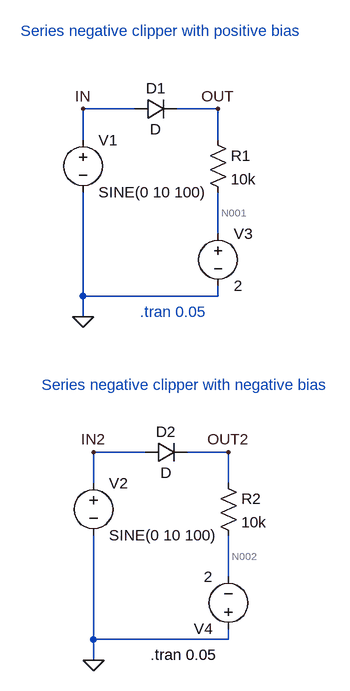
[diagram p0: schematic Series_Negative_clipper_with_bias.asc]
Series_Negative_clipper_with_bias.asc, the LTspice schematic file:
Version 4.1
SHEET 1 880 932
WIRE 176 64 96 64
WIRE 304 64 240 64
WIRE 96 112 96 64
WIRE 304 112 304 64
WIRE 304 256 304 192
WIRE 96 352 96 192
WIRE 304 352 304 336
WIRE 304 352 96 352
WIRE 96 384 96 352
WIRE 192 592 112 592
WIRE 320 592 256 592
WIRE 112 640 112 592
WIRE 320 640 320 592
WIRE 320 784 320 720
WIRE 112 880 112 720
WIRE 320 880 320 864
WIRE 320 880 112 880
WIRE 112 912 112 880
FLAG 96 64 IN
FLAG 304 64 OUT
FLAG 96 384 0
FLAG 112 592 IN2
FLAG 320 592 OUT2
FLAG 112 912 0
SYMBOL voltage 96 96 R0
WINDOW 123 0 0 Left 0
WINDOW 39 0 0 Left 0
SYMATTR InstName V1
SYMATTR Value SINE(0 10 100)
SYMBOL diode 176 80 R270
WINDOW 0 32 32 VTop 2
WINDOW 3 0 32 VBottom 2
SYMATTR InstName D1
SYMBOL res 288 96 R0
SYMATTR InstName R1
SYMATTR Value 10k
SYMBOL voltage 304 240 R0
WINDOW 123 0 0 Left 0
WINDOW 39 0 0 Left 0
SYMATTR InstName V3
SYMATTR Value 2
SYMBOL voltage 112 624 R0
WINDOW 123 0 0 Left 0
WINDOW 39 0 0 Left 0
SYMATTR InstName V2
SYMATTR Value SINE(0 10 100)
SYMBOL diode 192 608 R270
WINDOW 0 32 32 VTop 2
WINDOW 3 0 32 VBottom 2
SYMATTR InstName D2
SYMBOL res 304 624 R0
SYMATTR InstName R2
SYMATTR Value 10k
SYMBOL voltage 320 880 R180
WINDOW 123 0 0 Left 0
WINDOW 39 0 0 Left 0
SYMATTR InstName V4
SYMATTR Value 2
TEXT 184 376 Left 2 ;.tran 0.05
TEXT 0 -56 Left 2 ;Series negative clipper with positive bias
TEXT 32 488 Left 2 ;Series negative clipper with negative bias
TEXT 200 904 Left 2 !.tran 0.05

The netlist it stands for:
* Series_Negative_clipper_with_bias.asc
V1 IN 0 SINE(0 10 100)
D1 IN OUT D
R1 OUT N001 10k
V3 N001 0 2
V2 IN2 0 SINE(0 10 100)
D2 IN2 OUT2 D
R2 OUT2 N002 10k
V4 0 N002 2
.model D D
.lib standard.dio
* .tran 0.05
* Series negative clipper with positive bias
* Series negative clipper with negative bias
.tran 0.05
.backanno
.end

* Results of the author's LTspice run, read from the files saved beside the schematic
* Operating Point, zero values left out:
*   V(out) = 2 V
*   V(out2) = -604.2 mV
*   V(n001) = 2 V
*   V(n002) = -2 V
*   I(V1) = 2.01 pA
*   I(R1) = -2.01 pA
*   I(V2) = -139.6 µA
*   I(D2) = 139.6 µA
*   I(V4) = -139.6 µA
*   I(R2) = 139.6 µA
*   I(D1) = -2.01 pA
*   I(V3) = -2.01 pA
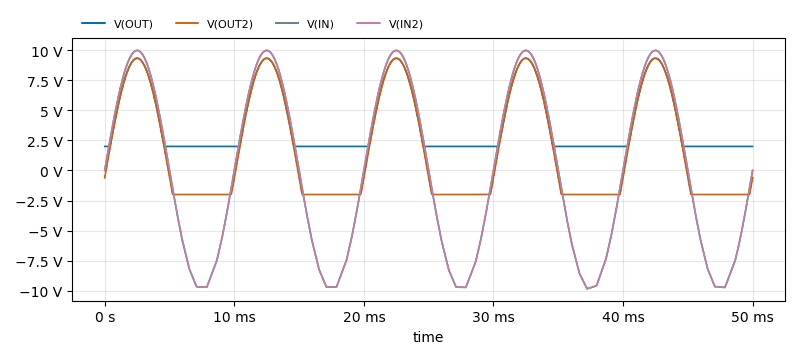
[diagram p1: Transient Analysis of Series_Negative_clipper_with_bias.asc, plotted from the saved traces]
* Transient Analysis, 1 run:
*   V(OUT): min 2 V, max 9.353 V, average 3.977 V, rms 4.836 V, last 2 V
*   V(OUT2): min -2 V, max 9.342 V, average 1.891 V, rms 4.791 V, last -604.2 mV
*   V(IN): min -9.848 V, max 10 V, average 39.11 mV, rms 7.037 V, last 0 V
*   V(IN2): min -9.848 V, max 10 V, average 39.11 mV, rms 7.037 V, last 0 V